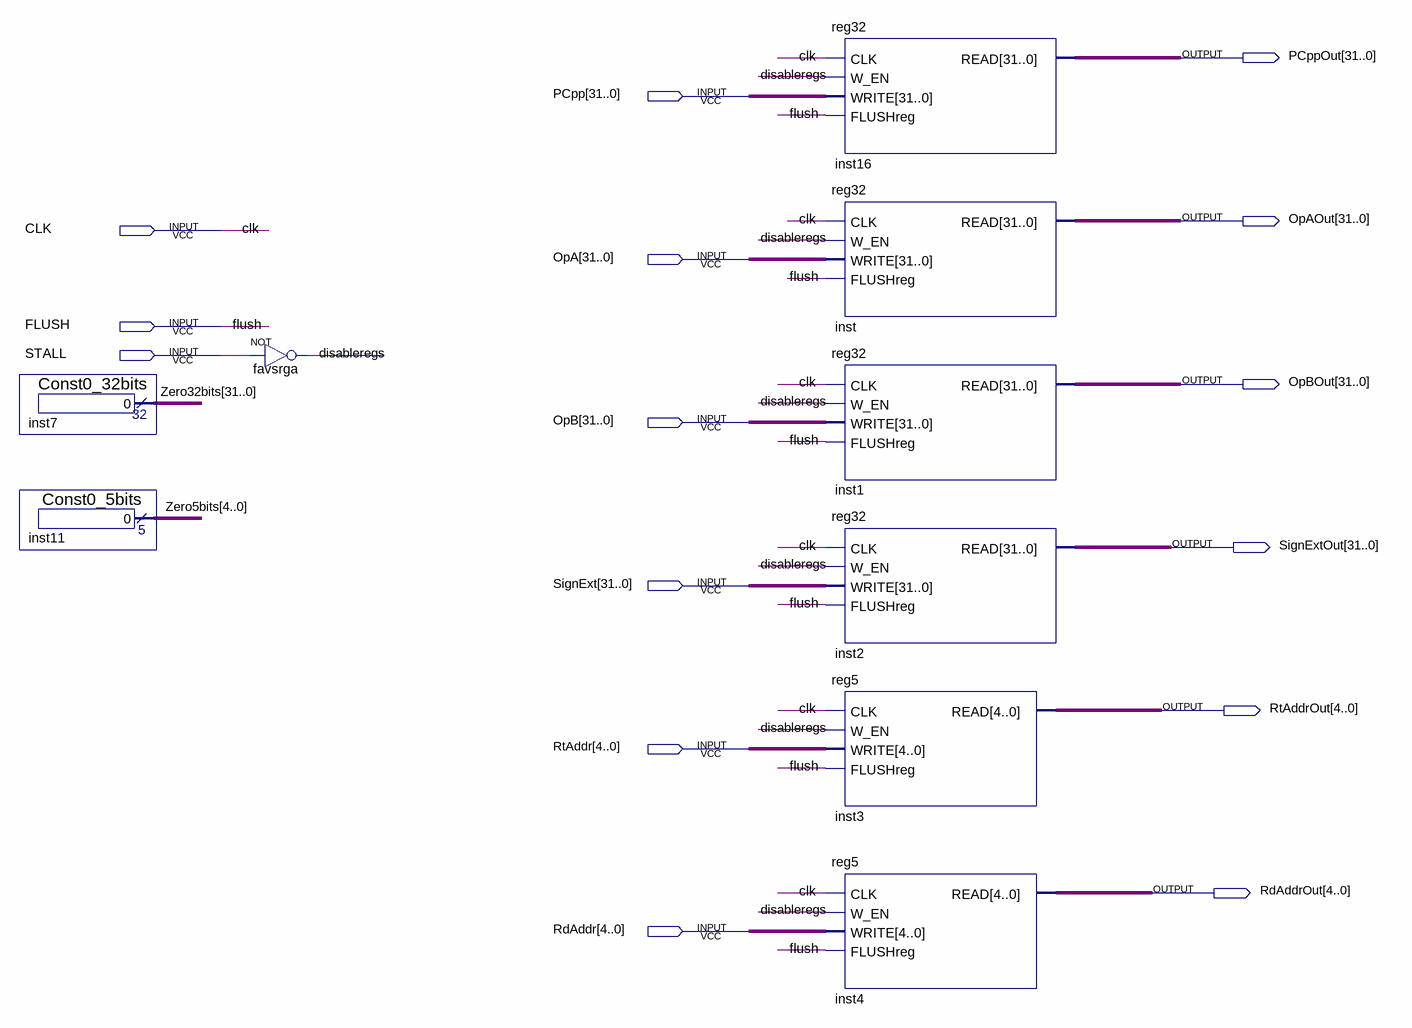
[diagram p0: schematic sheet]
// Quartus schematic ID-EX_barrier.bdf as structural Verilog: 9 symbols, 15 pins
module \ID-EX_barrier  (
  input  [31:0] PCpp,
  input  CLK,
  input  [31:0] OpA,
  input  FLUSH,
  input  STALL,
  input  [31:0] OpB,
  input  [31:0] SignExt,
  input  [4:0] RtAddr,
  input  [4:0] RdAddr,
  output [31:0] PCppOut,
  output [31:0] OpAOut,
  output [31:0] OpBOut,
  output [31:0] SignExtOut,
  output [4:0] RtAddrOut,
  output [4:0] RdAddrOut
);

  wire disableregs;
  wire [4:0] Zero5bits;
  wire [31:0] Zero32bits;

  Const0_32bits inst7 (.result(Zero32bits));
  Const0_5bits inst11 (.result(Zero5bits));
  not favsrga (disableregs, STALL);
  reg32 inst16 (.CLK(CLK), .W_EN(disableregs), .WRITE(PCpp), .FLUSHreg(FLUSH), .READ(PCppOut));
  reg32 inst (.CLK(CLK), .W_EN(disableregs), .WRITE(OpA), .FLUSHreg(FLUSH), .READ(OpAOut));
  reg32 inst1 (.CLK(CLK), .W_EN(disableregs), .WRITE(OpB), .FLUSHreg(FLUSH), .READ(OpBOut));
  reg32 inst2 (.CLK(CLK), .W_EN(disableregs), .WRITE(SignExt), .FLUSHreg(FLUSH), .READ(SignExtOut));
  reg5 inst3 (.CLK(CLK), .W_EN(disableregs), .WRITE(RtAddr), .FLUSHreg(FLUSH), .READ(RtAddrOut));
  reg5 inst4 (.CLK(CLK), .W_EN(disableregs), .WRITE(RdAddr), .FLUSHreg(FLUSH), .READ(RdAddrOut));
endmodule
